# EAGLE schematic riffleBoost (EAGLE 6.5.0)
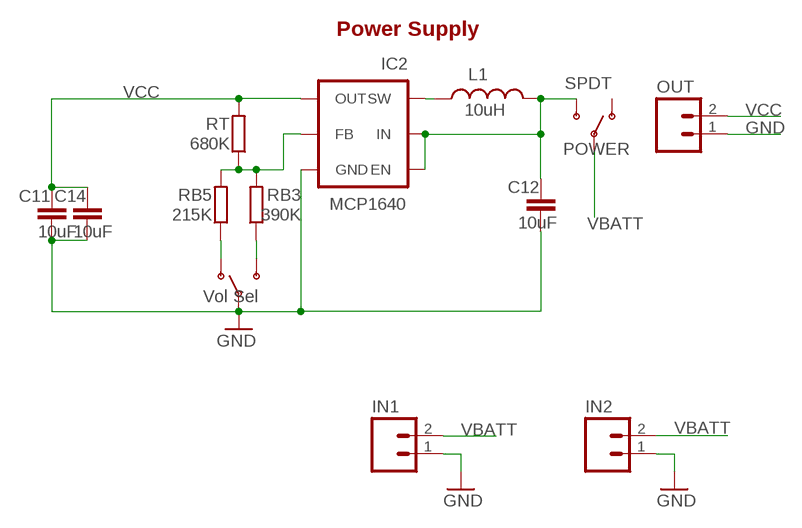
[diagram p0: schematic, sheet 1]

## Parts
C11  10uF  C-EUC0805  [C0805]
C12  10uF  C-EUC0805  [C0805]
C14  10uF  C-EUC0805  [C0805]
IC2  MCP1640  [TSOT23-6]
IN1  M02PTH  [1X02]
IN2  M02-JST-2MM-SMT  [JST-2-SMD]
L1  10uH  INDUCTOR_SMDD30  [INDUCTOR_D30]
OUT  M021X02_NO_SILK  [1X02_NO_SILK]
POWER  SPDT  SWITCH-SPSTSMD2  [SWITCH-SPDT-SMD]
RB3  390K  R-EU_R0805  [R0805]
RB5  215K  R-EU_R0805  [R0805]
RT  680K  R-EU_R0805  [R0805]
VOL1  Vol Sel  SWITCH-SPSTSMD2  [SWITCH-SPDT-SMD]

## Nets
GND [power]: C11.2 C12.2 C14.2 IC2.2(GND) IN1.1 IN2.1 OUT.1 VOL1.2(P)
N$2: IC2.4(FB) RB3.2 RB5.2 RT.1
N$18: RB5.1 VOL1.1(O)
N$19: RB3.1 VOL1.3(S)
N$26 [power]: IC2.1(SW) L1.P$2
PWR [power]: C12.1 IC2.3(EN) IC2.6(IN) L1.P$1 POWER.3(S)
VBATT: IN1.2 IN2.2 POWER.2(P)
VCC: C11.1 C14.1 IC2.5(OUT) OUT.2 RT.2
Unconnected: POWER.1(O)

## Notes on the sheet
- Power Supply

## Library data of the parts
C11 C12 C14 = resistor:C-EU: CAPACITOR, European symbol
IC2 = linear-technology:MCP1640
IN1 IN2 OUT = SparkFun:M02: Header 2 Standard 2-pin 0.1" header. Use with straight break away headers (SKU : PRT-00116), right angle break away headers (PRT-00553), swiss pins (PRT-00743), machine pins (PRT-00117), and female headers (PRT-00115). Molex polarized connector foot print use with SKU : PRT-08233 with associated crimp pins and housings.
L1 = linear-technology:INDUCTOR_SMD
POWER VOL1 = SparkFun:SWITCH-SPST: SPST Switch Simple slide switch. Spark Fun Electronics SKU : COM-00102
RB3 RB5 RT = rcl:R-EU_: RESISTOR, European symbol

## Net classes
0 Default: width 0.203 mm
1 power: width 0.406 mm, clearance 0.203 mm